# Altium schematic sheet Sheet2.SchDoc
size A4; SheetNumber: 2; SheetTotal: 3
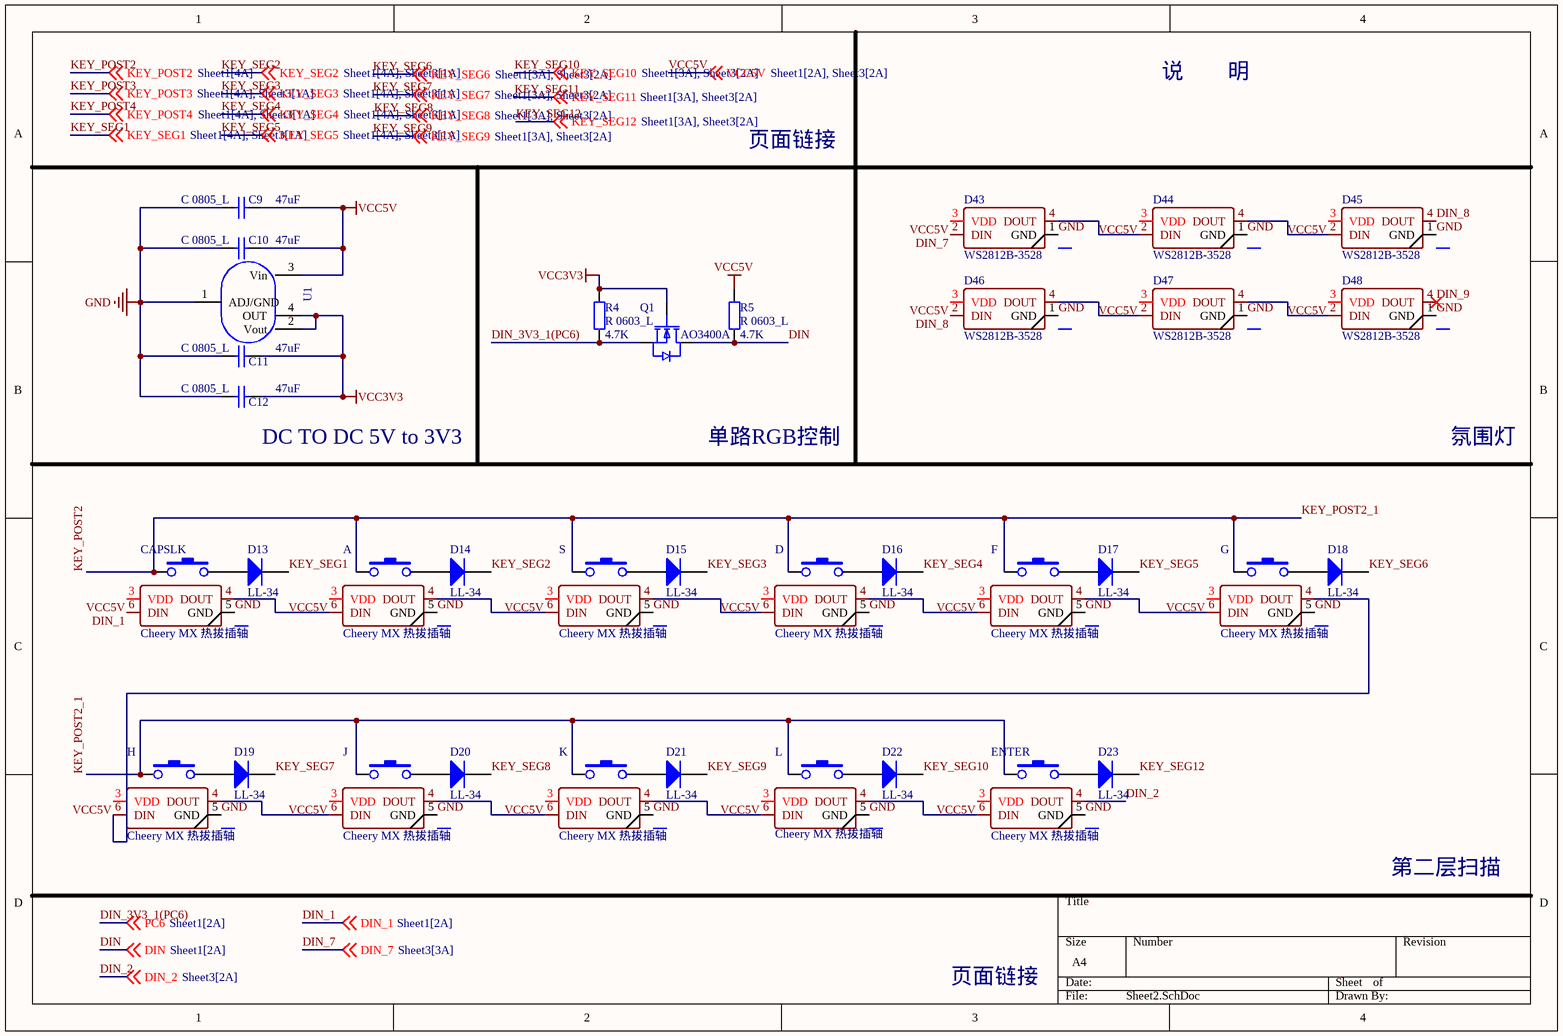
[diagram p0: Sheet2.SchDoc]

## Parts
A  Cheery MX 热拔插轴  [MX_SW-HOTPLUG]
C9  C 0805_L  value 47uF  [C 0805_L]
C10  C 0805_L  value 47uF  [C 0805_L]
C11  C 0805_L  value 47uF  [C 0805_L]
C12  C 0805_L  value 47uF  [C 0805_L]
CAPSLK  Cheery MX 热拔插轴  [MX_SW-HOTPLUG]
D  Cheery MX 热拔插轴  [MX_SW-HOTPLUG]
D13  LL-34  [LL-34_L3.7-W1.6-RD]
D14  LL-34  [LL-34_L3.7-W1.6-RD]
D15  LL-34  [LL-34_L3.7-W1.6-RD]
D16  LL-34  [LL-34_L3.7-W1.6-RD]
D17  LL-34  [LL-34_L3.7-W1.6-RD]
D18  LL-34  [LL-34_L3.7-W1.6-RD]
D19  LL-34  [LL-34_L3.7-W1.6-RD]
D20  LL-34  [LL-34_L3.7-W1.6-RD]
D21  LL-34  [LL-34_L3.7-W1.6-RD]
D22  LL-34  [LL-34_L3.7-W1.6-RD]
D23  LL-34  [LL-34_L3.7-W1.6-RD]
D43  WS2812B-3528  [WS2812B-3528，反贴RGBLED灯]
D44  WS2812B-3528  [WS2812B-3528，反贴RGBLED灯]
D45  WS2812B-3528  [WS2812B-3528，反贴RGBLED灯]
D46  WS2812B-3528  [WS2812B-3528，反贴RGBLED灯]
D47  WS2812B-3528  [WS2812B-3528，反贴RGBLED灯]
D48  WS2812B-3528  [WS2812B-3528，反贴RGBLED灯]
ENTER  Cheery MX 热拔插轴  [MX_SW-HOTPLUG]
F  Cheery MX 热拔插轴  [MX_SW-HOTPLUG]
G  Cheery MX 热拔插轴  [MX_SW-HOTPLUG]
H  Cheery MX 热拔插轴  [MX_SW-HOTPLUG]
J  Cheery MX 热拔插轴  [MX_SW-HOTPLUG]
K  Cheery MX 热拔插轴  [MX_SW-HOTPLUG]
L  Cheery MX 热拔插轴  [MX_SW-HOTPLUG]
Q1  AO3400A  [AO3400A]
R4  R 0603_L  value 4.7K  [R 0603_L]
R5  R 0603_L  value 4.7K  [R 0603_L]
S  Cheery MX 热拔插轴  [MX_SW-HOTPLUG]
U1  SPX1117M3-L-3-3  [SPX1117M3-L-3-3/TR]  (value not drawn)

## Nets
GND: A.5(GND) C9.1 C10.1 C11.1 C12.1 CAPSLK.5(GND) D.5(GND) D43.1(GND) D44.1(GND) D45.1(GND) D46.1(GND) D47.1(GND) D48.1(GND) ENTER.5(GND) F.5(GND) G.5(GND) H.5(GND) J.5(GND) K.5(GND) L.5(GND) S.5(GND) U1.1(ADJ/GND)
VCC3V3: C11.2 C12.2 Q1.1(G) R4.2 U1.2(Vout) U1.4(OUT)
VCC5V: A.3(VDD) C9.2 C10.2 CAPSLK.3(VDD) D.3(VDD) D43.3(VDD) D44.3(VDD) D45.3(VDD) D46.3(VDD) D47.3(VDD) D48.3(VDD) ENTER.3(VDD) F.3(VDD) G.3(VDD) H.3(VDD) J.3(VDD) K.3(VDD) L.3(VDD) R5.2 S.3(VDD) U1.3(Vin) ; off-sheet VCC5V
DIN: Q1.3(D) R5.1 ; off-sheet DIN
DIN_1: CAPSLK.6(DIN) ; off-sheet DIN_1
DIN_2: ENTER.4(DOUT) ; off-sheet DIN_2
DIN_3V3_1(PC6): Q1.2(S) R4.1 ; off-sheet PC6  [also labelled PC6]
DIN_7: D43.2(DIN) ; off-sheet DIN_7
DIN_8: D45.4(DOUT) D46.2(DIN)
DIN_9: D48.4(DOUT)
KEY_POST2: A.1 CAPSLK.1 D.1 ENTER.1 F.1 G.1 H.1 J.1 K.1 L.1 S.1 ; off-sheet KEY_POST2  [also labelled KEY_POST2_1]
KEY_SEG1: D13.2(K) ; off-sheet KEY_SEG1
KEY_SEG2: D14.2(K) ; off-sheet KEY_SEG2
KEY_SEG3: D15.2(K) ; off-sheet KEY_SEG3
KEY_SEG4: D16.2(K) ; off-sheet KEY_SEG4
KEY_SEG5: D17.2(K) ; off-sheet KEY_SEG5
KEY_SEG6: D18.2(K) ; off-sheet KEY_SEG6
KEY_SEG7: D19.2(K) ; off-sheet KEY_SEG7
KEY_SEG8: D20.2(K) ; off-sheet KEY_SEG8
KEY_SEG9: D21.2(K) ; off-sheet KEY_SEG9
KEY_SEG10: D22.2(K) ; off-sheet KEY_SEG10
KEY_SEG12: D23.2(K) ; off-sheet KEY_SEG12
NetA_2: A.2 D14.1(A)
NetA_4: A.4(DOUT) S.6(DIN)
NetA_6: A.6(DIN) CAPSLK.4(DOUT)
NetCAPSLK_2: CAPSLK.2 D13.1(A)
NetD15_1: D15.1(A) S.2
NetD17_1: D17.1(A) F.2
NetD18_1: D18.1(A) G.2
NetD19_1: D19.1(A) H.2
NetD20_1: D20.1(A) J.2
NetD21_1: D21.1(A) K.2
NetD22_1: D22.1(A) L.2
NetD23_1: D23.1(A) ENTER.2
NetD43_4: D43.4(DOUT) D44.2(DIN)
NetD44_4: D44.4(DOUT) D45.2(DIN)
NetD46_4: D46.4(DOUT) D47.2(DIN)
NetD47_4: D47.4(DOUT) D48.2(DIN)
NetD_2: D.2 D16.1(A)
NetD_4: D.4(DOUT) F.6(DIN)
NetD_6: D.6(DIN) S.4(DOUT)
NetENTER_6: ENTER.6(DIN) L.4(DOUT)
NetF_4: F.4(DOUT) G.6(DIN)
NetG_4: G.4(DOUT) H.6(DIN)
NetH_4: H.4(DOUT) J.6(DIN)
NetJ_4: J.4(DOUT) K.6(DIN)
NetK_4: K.4(DOUT) L.6(DIN)

## Notes on the sheet
- 说        明
- 页面链接
- (near C12) DC TO DC 5V to 3V3
- 单路RGB控制
- 氛围灯
- 第二层扫描

## Library data of the parts
A CAPSLK D ENTER F G H J K L S = Cheery MX 热拔插轴: 机械键盘轴（Cheery MX）
C9-C12 = C 0805_L: Capacitor; Published: 8-Jun-2000; LatestRevisionDate: 17-Jul-2002; LatestRevisionNote: Re-released for DXP Platform.; PackageReference: RAD-0.3; Publisher: Altium Limited; PackageDescription: Radial Cap, Thru-Hole; 2 Leads; 0.3 in Pin Spacing
D13-D23 = LL4148: 开关二极管（Switching diode）; Published: 8-Jun-2000; LatestRevisionDate: 17-Jul-2002; LatestRevisionNote: Re-released for DXP Platform.; PackageVersion: Sep-1996; PackageReference: SMC; Publisher: Altium Limited; PackageDescription: DO-214-AB/SMC; 2 C-Bend Leads; Body 7.9 x 5.9 mm, inc. leads (LxW); Code_JEDEC: DO-214-AB
D43-D48 = WS2812B-3528: WS2812B-3528,反贴LED，RGB灯
Q1 = 2N7002,215: Manufacturer: Nexperia(安世); Add into BOM: yes; Type: N沟道; Drain Source Voltage (Vdss): 60V; Continuous Drain Current (Id): 300mA; Power Dissipation (Pd): 830mW; Drain Source On Resistance (RDS(on)@Vgs,Id): 5Ω@10V,500mA; Gate Threshold Voltage (Vgs(th)@Id): 2.5V@250A; Symbol: 2N7002,215; Device: 2N7002,215; LCSC Part Name: N沟道 60V 300mA; Supplier Part: C65189; Manufacturer Part: 2N7002,215; Supplier Footprint: SOT-23(SOT-23-3); JLCPCB Part Class: Extended Part; Datasheet: https://atta.szlcsc.com/upload/public/pdf/source/20170103/1483439882638.pdf; Supplier: LCSC; Convert to PCB: yes
R4 R5 = R 0603_L: Resistor; Published: 8-Jun-2000; LatestRevisionDate: 17-Jul-2002; LatestRevisionNote: Re-released for DXP Platform.; PackageReference: AXIAL-0.4; Publisher: Altium Limited; PackageDescription: Axial Device, Thru-Hole; 2 Leads; 0.4 in Pin Spacing
U1 = SPX1117M3-L-3-3: Manufacturer: UTC(友顺); Symbol: LM317G-AA3-R; Add into BOM: yes; Output Type: 可调; Output Polarity: 正; Number of Outputs: 1; Maximum Input Voltage: 40V; Output Voltage: 1.3V~37V; Dropout Voltage: 5V@(10mA); Output Current: 1A; Device: LM317G-AA3-R; LCSC Part Name: Vin=40V Vout=1.3V~37V 1A; Supplier Part: C19651; Manufacturer Part: LM317G-AA3-R; Supplier Footprint: SOT-223; JLCPCB Part Class: Extended Part; Datasheet: https://atta.szlcsc.com/upload/public/pdf/source/20160416/1460799387250.pdf; Supplier: LCSC; Convert to PCB: yes